# EAGLE schematic ESP8266_SMD_0603 (EAGLE 9.6.2)
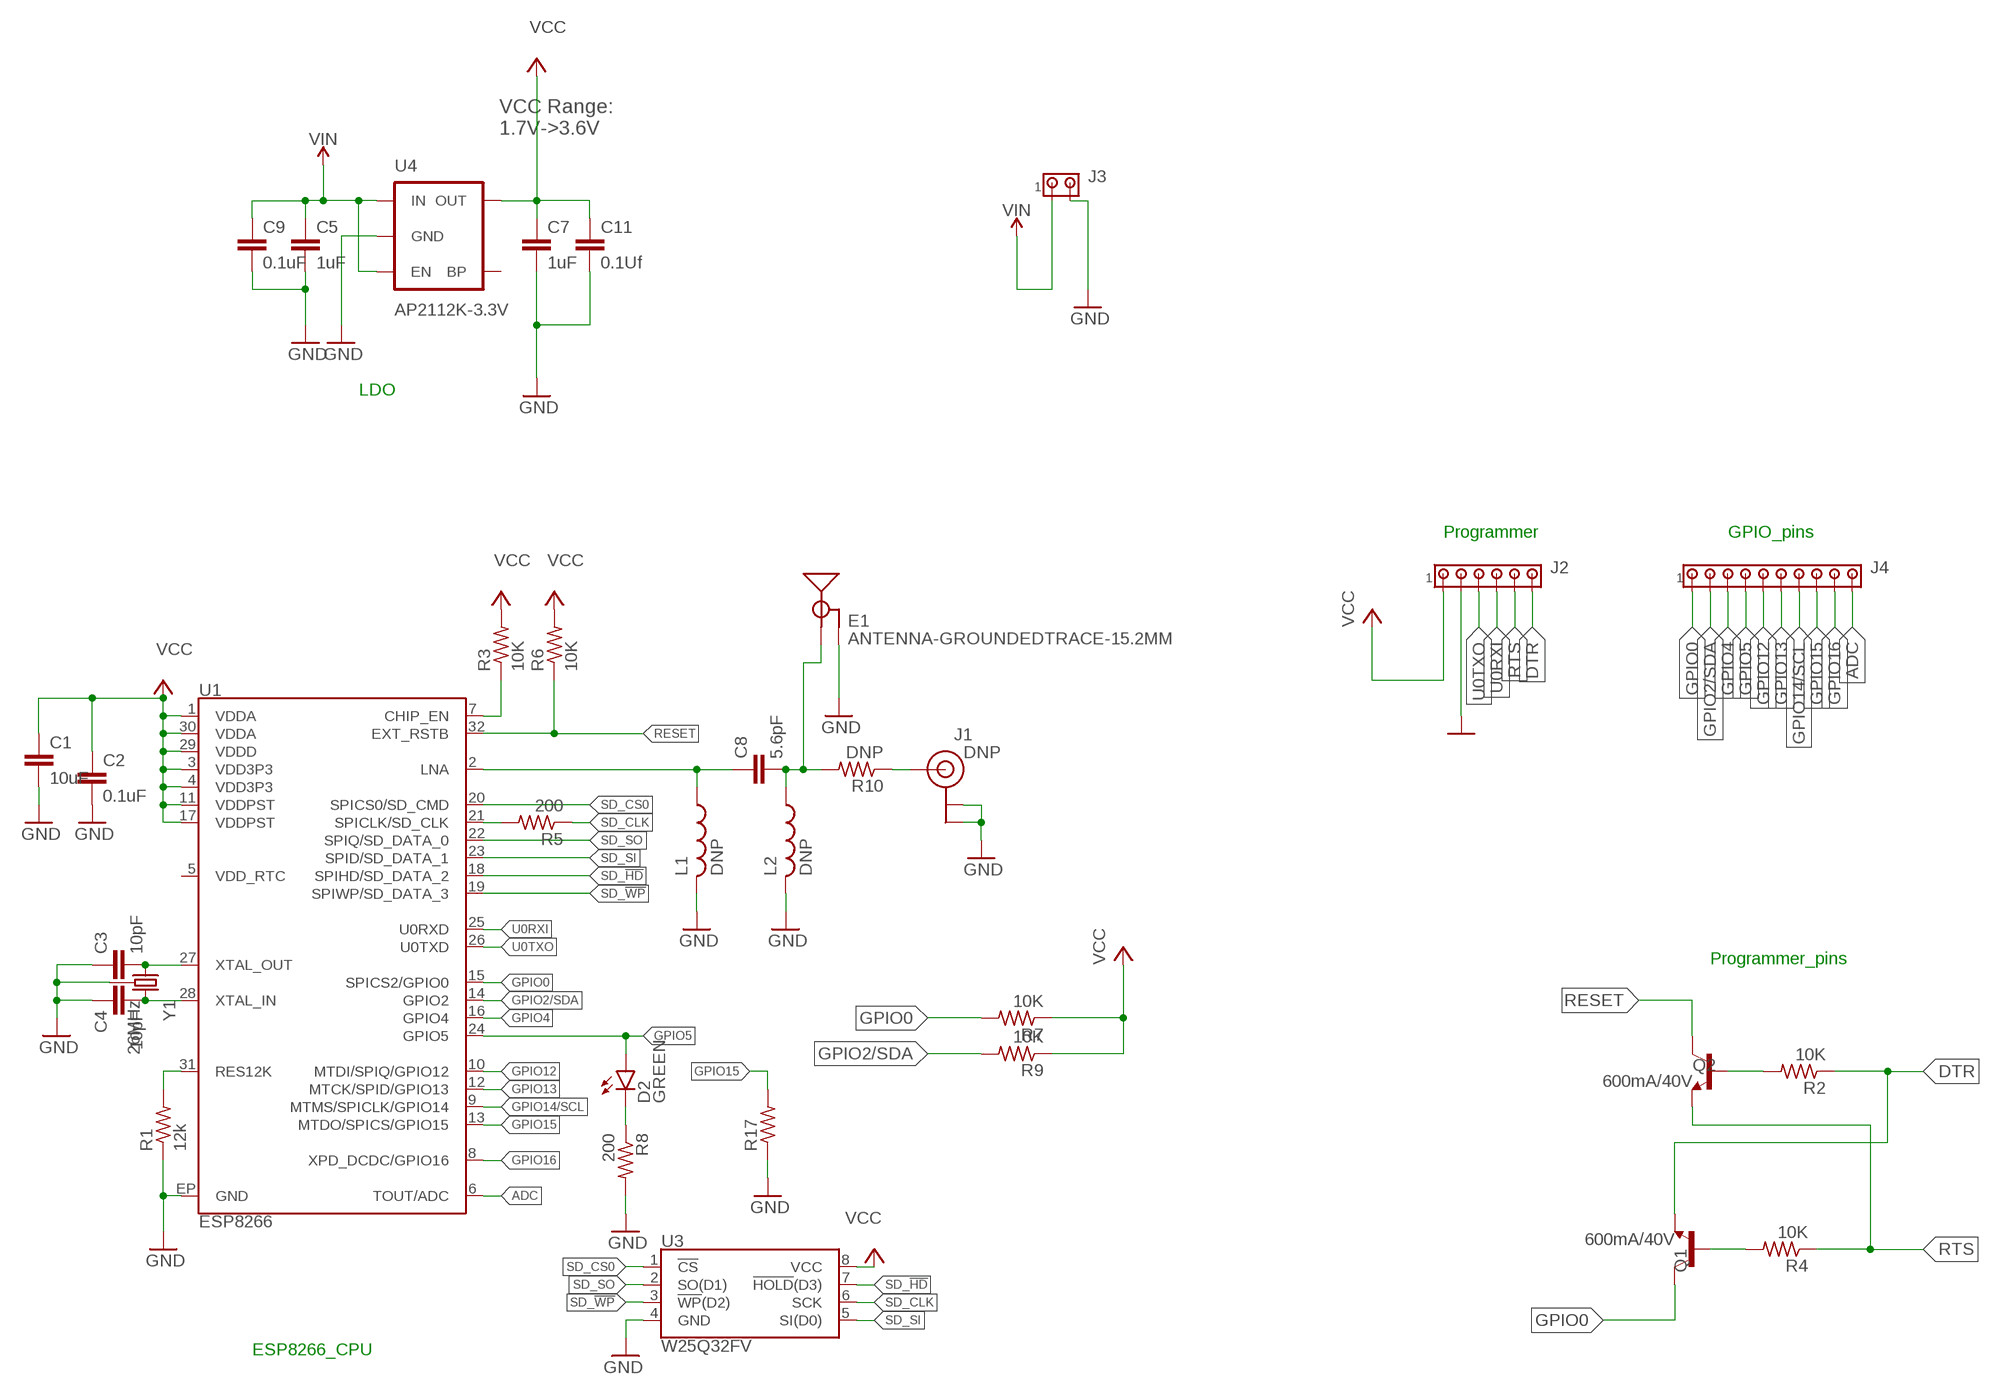
[diagram p0: schematic, sheet 1]

## Parts
C1  10uF  C-EUC0603  [C0603]
C2  0.1uF  C-EUC0603  [C0603]
C3  10pF  C-EUC0603  [C0603]
C4  10pF  C-EUC0603  [C0603]
C5  1uF  C-EUC0603  [C0603]
C7  1uF  C-EUC0603  [C0603]
C8  5.6pF  C-EUC0603  [C0603]
C9  0.1uF  C-EUC0603  [C0603]
C11  0.1Uf  C-EUC0603  [C0603]
D2  GREEN  LED-GREEN0603  [LED-0603]
E1  ANTENNA-GROUNDEDTRACE-15.2MM  [TRACE_ANTENNA_2.4GHZ_15.2MM]
J1  DNP  U.FL  [U.FL]
J2  MTA06-100  [10X06MTA]
J3  MTA02-100  [10X02MTA]
J4  MTA10-100  [10X10MTA]
L1  DNP  L-USL0603  [L0603]
L2  DNP  L-USL0603  [L0603]
Q1  600mA/40V  TRANS_NPN-MMBT2222AL  [SOT23-3]
Q2  600mA/40V  TRANS_NPN-MMBT2222AL  [SOT23-3]
R1  12k  R-US_R0603  [R0603]
R2  10K  R-US_R0603  [R0603]
R3  10K  R-US_R0603  [R0603]
R4  10K  R-US_R0603  [R0603]
R5  200  R-US_R0603  [R0603]
R6  10K  R-US_R0603  [R0603]
R7  10K  R-US_R0603  [R0603]
R8  200  R-US_R0603  [R0603]
R9  10K  R-US_R0603  [R0603]
R10  DNP  R-US_R0603  [R0603]
R17  10K  R-US_R0603  [R0603]
U1  ESP8266  [QFN32]
U3  W25Q32FV  W25Q32FVSS  [SOIC-8]
U4  AP2112K-3.3V  V_REG_LDOSMD  [SOT23-5]
Y1  26MHz  CRYSTAL-GROUNDED3.2X2.5  [CRYSTAL-SMD-3.2X2.5]

## Nets
ADC: J4.10 U1.6(TOUT/ADC)
ANT: J1.P$3(SIGNAL) R10.1
CHIP_EN: R3.1 U1.7(CHIP_EN)
DTR: J2.6 Q1.2(E) R2.1
GND: C1.2 C2.2 C3.1 C4.1 C5.2 C7.2 C9.2 C11.2 E1.GND J1.P$1(GND) J1.P$2(GND) J2.2 J3.2 L1.2 L2.2 R1.1 R8.2 R17.1 U1.EP(GND) U3.4(GND) U4.2(GND) Y1.2(GND) Y1.4(GND)
GPIO0: J4.1 Q1.3(C) R7.2 U1.15(SPICS2/GPIO0)
GPIO2/SDA: J4.2 R9.2 U1.14(GPIO2)
GPIO4: J4.3 U1.16(GPIO4)
GPIO5: D2.A J4.4 U1.24(GPIO5)
GPIO12: J4.5 U1.10(MTDI/SPIQ/GPIO12)
GPIO13: J4.6 U1.12(MTCK/SPID/GPIO13)
GPIO14/SCL: J4.7 U1.9(MTMS/SPICLK/GPIO14)
GPIO15: J4.8 R17.2 U1.13(MTDO/SPICS/GPIO15)
GPIO16: J4.9 U1.8(XPD_DCDC/GPIO16)
LNA: C8.1 L1.1 U1.2(LNA)
N$1: R1.2 U1.31(RES12K)
N$2: C4.2 U1.28(XTAL_IN) Y1.3
N$3: C3.2 U1.27(XTAL_OUT) Y1.1
N$4: Q1.1(B) R4.2
N$6: R5.2 U1.21(SPICLK/SD_CLK)
N$8: Q2.1(B) R2.2
N$15: D2.C R8.1
RESET: Q2.3(C) R6.1 U1.32(EXT_RSTB)
RTS: J2.5 Q2.2(E) R4.1
SD_!HD!: U1.18(SPIHD/SD_DATA_2) U3.7(!HOLD!(D3))
SD_!WP!: U1.19(SPIWP/SD_DATA_3) U3.3(!WP!(D2))
SD_CLK: R5.1 U3.6(SCK)
SD_CS0: U1.20(SPICS0/SD_CMD) U3.1(!CS!)
SD_SI: U1.23(SPID/SD_DATA_1) U3.5(SI(D0))
SD_SO: U1.22(SPIQ/SD_DATA_0) U3.2(SO(D1))
TRACE_ANT: C8.2 E1.ANT(SIGNAL) L2.1 R10.2
U0RXI: J2.4 U1.25(U0RXD)
U0TXO: J2.3 U1.26(U0TXD)
VCC: C1.1 C2.1 C7.1 C11.1 J2.1 R3.2 R6.2 R7.1 R9.1 U1.1(VDDA) U1.3(VDD3P3) U1.4(VDD3P3) U1.11(VDDPST) U1.17(VDDPST) U1.29(VDDD) U1.30(VDDA) U3.8(VCC) U4.5(OUT)
VIN: C5.1 C9.1 J3.1 U4.1(IN) U4.3(EN)
Unconnected: U1.5(VDD_RTC) U4.4(BP)

## Notes on the sheet
- VCC Range:
  1.7V->3.6V
- LDO
- Programmer | GPIO_pins
- DNP
- Programmer_pins
- ESP8266_CPU

## Library data of the parts
C1 C2 = resistor:C-EU: CAPACITOR, European symbol
C3-C5 C7-C9 C11 = rcl:C-EU: CAPACITOR, European symbol; SPICEPREFIX: C
D2 = SparkFun-LED:LED-GREEN: Various green LEDs Green LEDs used in SFE Production 0603- DIO-00821 LARGE- DIO-00862 LILYPAD- DIO-09910; PROD_ID: DIO-00821
E1 = SparkFun-RF:ANTENNA-GROUNDED: Antenna w/ Ground Connection 2.4GHz antennae with signal and ground terminals. TRACE_ANTENNA_2.4GHZ_15.2MM - Meander Trace antenna 15.2 x 5.7mm footprint Based on layout from TI app note AN043 <http://www.ti.com/lit/an/swra117d/swra117d.pdf>. TRACE_ANTENNA_2.4GHZ_25.7MM - Inverted F trace antenna 25.7 x 7.5 mm footprint. Based on layout from TI design note DN0007 <http://www.ti.com/lit/an/swru120b/swru120b.pdf>.
J1 = SparkFun-Connectors:U.FL: SMD antenna connector- WRL-09144; PROD_ID: CONN-09193; VALUE: U.FL
J2 = con-amp:MTA06-100: AMP connector Connection corrected 2014-09-19
J3 = con-amp:MTA02-100: AMP connector
J4 = con-amp:MTA10-100: AMP connector
L1 L2 = rcl-2:L-US: INDUCTOR, American symbol
Q1 Q2 = SparkFun-DiscreteSemi:TRANS_NPN: NPN transistor Current controlled devices typically used to amplify current or used as a switch. BC547 - COM-08928 <http://www.sparkfun.com/products/8928> (TO-92 45V 100mA) (1.Collector 2.Base 3.Emitter) 2N3904 - COM-00521 <http://www.sparkfun.com/products/521> (TO-92 40V 200mA) (1.Emitter 2.Base 3.Collector) P2N2222A - COM-12852 <http://www.sparkfun.com/products/12852> (TO-92 40V 600mA) (1.Collector 2.Base 3.Emitter); PROD_ID: TRANS-08049
R1-R10 R17 = rcl:R-US_: RESISTOR, American symbol; SPICEPREFIX: R
U1 = esp8266-development-board:ESP8266: Espressif ESP8266 WiFi Smart Connectivity Platform.
U3 = SparkFun-IC-Memory:W25Q32FV: W25Q32FV 32Mb (4MB) Serial Flash Memory The W25Q32FV support the standard Serial Peripheral Interface (SPI), Dual/Quad I/O SPI as well as 2-clocks instruction cycle Quad Peripheral Interface (QPI). 104MHz, SPI, 8-SOIC-EIAJ Datasheet <http://www.winbond.com/resource-files/w25q32fv%20revh%20091613.pdf> SparkFun Products SparkFun Blynk Board - ESP8266 <https://www.sparkfun.com/products/13794> (WRL-13794); PROD_ID: IC-13229
U4 = SparkFun-PowerIC:V_REG_LDO: Voltage Regulator LDO Standard 150mA LDO voltage regulator in SOT-23 layout. Micrel part MIC5205. BP (by-pass) pin is used to lower output noise with 470pF cap.; PROD_ID: VREG-12457
Y1 = things:CRYSTAL-GROUNDED; PROD_ID: XTAL-12454